# EAGLE design fb20-5 (EAGLE 6.3)
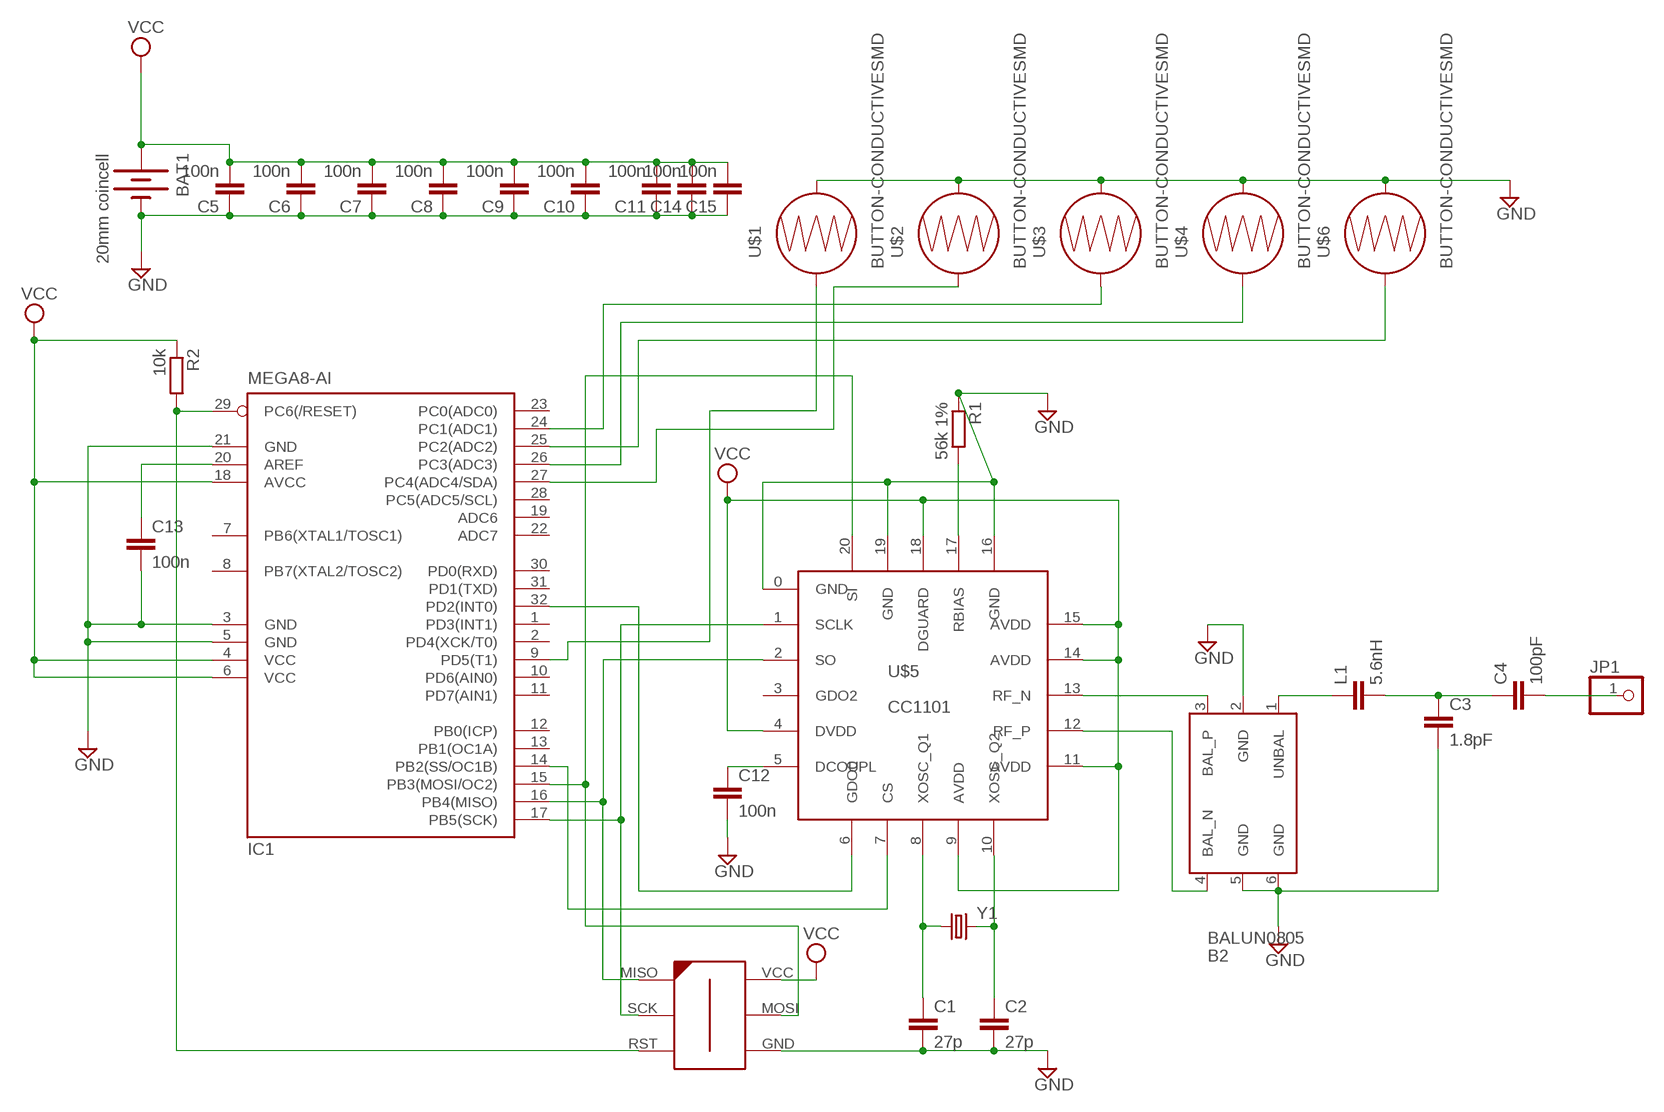
[diagram p0: schematic, sheet 1]

## Parts
B2  BALUN0805  [BALUN]
BAT1  20mm coincell  BATTERY20MM_4LEGS  [BATTCON_20MM_4LEGS]
C1  27p  C-EUC0402  [C0402]
C2  27p  C-EUC0402  [C0402]
C3  1.8pF  C-EUC0402  [C0402]
C4  100pF  C-EUC0402  [C0402]
C5  100n  C-EUC0402  [C0402]
C6  100n  C-EUC0402  [C0402]
C7  100n  C-EUC0402  [C0402]
C8  100n  C-EUC0402  [C0402]
C9  100n  C-EUC0402  [C0402]
C10  100n  C-EUC0402  [C0402]
C11  100n  C-EUC0402  [C0402]
C12  100n  C-EUC0402  [C0402]
C13  100n  C-EUC0402  [C0402]
C14  100n  C-EUC0402  [C0402]
C15  100n  C-EUC0402  [C0402]
IC1  MEGA8-AI  [TQFP32-08]
JP1  PINHD-1X1  [1X01]
L1  5.6nH  C-EUC0603  [C0603]
R1  56k 1%  R-EU_R0402  [R0402]
R2  10k  R-EU_R0402  [R0402]
U$1  BUTTON-CONDUCTIVESMD  [BUTTON-CONDUCTIVE]
U$2  BUTTON-CONDUCTIVESMD  [BUTTON-CONDUCTIVE]
U$3  BUTTON-CONDUCTIVESMD  [BUTTON-CONDUCTIVE]
U$4  BUTTON-CONDUCTIVESMD  [BUTTON-CONDUCTIVE]
U$5  CC1101  [QFN20]
U$6  BUTTON-CONDUCTIVESMD  [BUTTON-CONDUCTIVE]
U$7  AVR-ISP-6-EDGE  [6PAD_ISP]
Y1  CRYSTAL5X3  [CRYSTAL-SMD-5X3]

## Nets
GND: B2.2(GND) B2.5(GND) B2.6(GND) BAT1.2(-) C1.2 C2.2 C3.2 C5.1 C6.1 C7.1 C8.1 C9.1 C10.1 C11.1 C12.2 C13.2 C14.1 C15.1 IC1.3(GND) IC1.5(GND) IC1.21(GND) R1.1 U$1.2 U$2.2 U$3.2 U$4.2 U$5.0(GND) U$5.16(GND) U$5.19(GND) U$6.2 U$7.GND
N$1: B2.3(BAL_P) U$5.13(RF_N)
N$2: B2.4(BAL_N) U$5.12(RF_P)
N$3: C1.1 U$5.8(XOSC_Q1) Y1.1
N$4: C2.1 U$5.10(XOSC_Q2) Y1.3
N$5: IC1.17(PB5(SCK)) U$5.1(SCLK) U$7.SCK
N$6: IC1.14(PB2(SS/OC1B)) U$5.7(CS)
N$7: IC1.29(PC6(/RESET)) R2.2 U$7.RST
N$8: IC1.32(PD2(INT0)) U$5.6(GDO0)
N$9: B2.1(UNBAL) L1.1
N$10: C3.1 C4.1 L1.2
N$11: R1.2 U$5.17(RBIAS)
N$12: IC1.16(PB4(MISO)) U$5.2(SO) U$7.MISO
N$13: IC1.15(PB3(MOSI/OC2)) U$5.20(SI) U$7.MOSI
N$14: C12.1 U$5.5(DCOUPL)
N$15: C13.1 IC1.20(AREF)
N$16: IC1.9(PD5(T1)) U$1.1
N$17: IC1.27(PC4(ADC4/SDA)) U$2.1
N$18: IC1.24(PC1(ADC1)) U$3.1
N$19: IC1.26(PC3(ADC3)) U$4.1
N$20: C4.2 JP1.1
N$21: IC1.25(PC2(ADC2)) U$6.1
VCC: BAT1.1(+) C5.2 C6.2 C7.2 C8.2 C9.2 C10.2 C11.2 C14.2 C15.2 IC1.4(VCC) IC1.6(VCC) IC1.18(AVCC) R2.1 U$5.4(DVDD) U$5.9(AVDD) U$5.11(AVDD) U$5.14(AVDD) U$5.15(AVDD) U$5.18(DGUARD) U$7.VCC
Unconnected: IC1.1(PD3(INT1)) IC1.2(PD4(XCK/T0)) IC1.7(PB6(XTAL1/TOSC1)) IC1.8(PB7(XTAL2/TOSC2)) IC1.10(PD6(AIN0)) IC1.11(PD7(AIN1)) IC1.12(PB0(ICP)) IC1.13(PB1(OC1A)) IC1.19(ADC6) IC1.22(ADC7) IC1.23(PC0(ADC0)) IC1.28(PC5(ADC5/SCL)) IC1.30(PD0(RXD)) IC1.31(PD1(TXD)) U$5.3(GDO2)

## Library data of the parts
B2 = Alis custom parts:BALUN: 0805 footprint balun- Ember 351/357
BAT1 = Alis custom parts:BATTERY: Battery Holders Various common sizes : AA, AAA, 20mm coin cell and 12mm coin cell. 20MM_4LEGS, BATT-10373; PROD_ID: BATT-10373
C1-C15 L1 = rcl:C-EU: CAPACITOR, European symbol
IC1 = atmel:MEGA8: MICROCONTROLLER 8 Kbytes FLASH, 1 kbytes SRAM, 512 bytes EEPROM, USART, 6-channel 10 bit ADC, 2-channel 8 bit ADC Pin compatible with Atmega48, ATMega88, ATMega168 Source: avr.lbr; MPN: ATMEGA8-16AU; OC_FARNELL: 9171371; OC_NEWARK: 73M8863
JP1 = pinhead:PINHD-1X1: PIN HEADER
R1 R2 = rcl:R-EU_: RESISTOR, European symbol
U$1-U$4 U$6 = Alis custom parts:BUTTON-CONDUCTIVE: Used with rubber key pads. This one was designed and proven to work with the PolyCase Key FOB enclosures.
U$5 = Alis custom parts:CC1101
U$7 = avr-7:AVR-ISP-6-EDGE: 6 pin edge connector for ISP with ATMEL MCUs. Developed by Craig Moates (craig at moates dot net). Library by David Blundell (blundar at gmail dot com). Often, even a 6 pin header is really inconvenient for board layout and/or production. This SMD-only header is our de-facto standard for using an edge connector for programming with the help of a 6pin/10pin to edge card adapter.
Y1 = SparkFun-FreqCtrl:CRYSTAL: Various standard crystals. Proven footprints. Spark Fun Electronics SKU : COM-00534

## Board
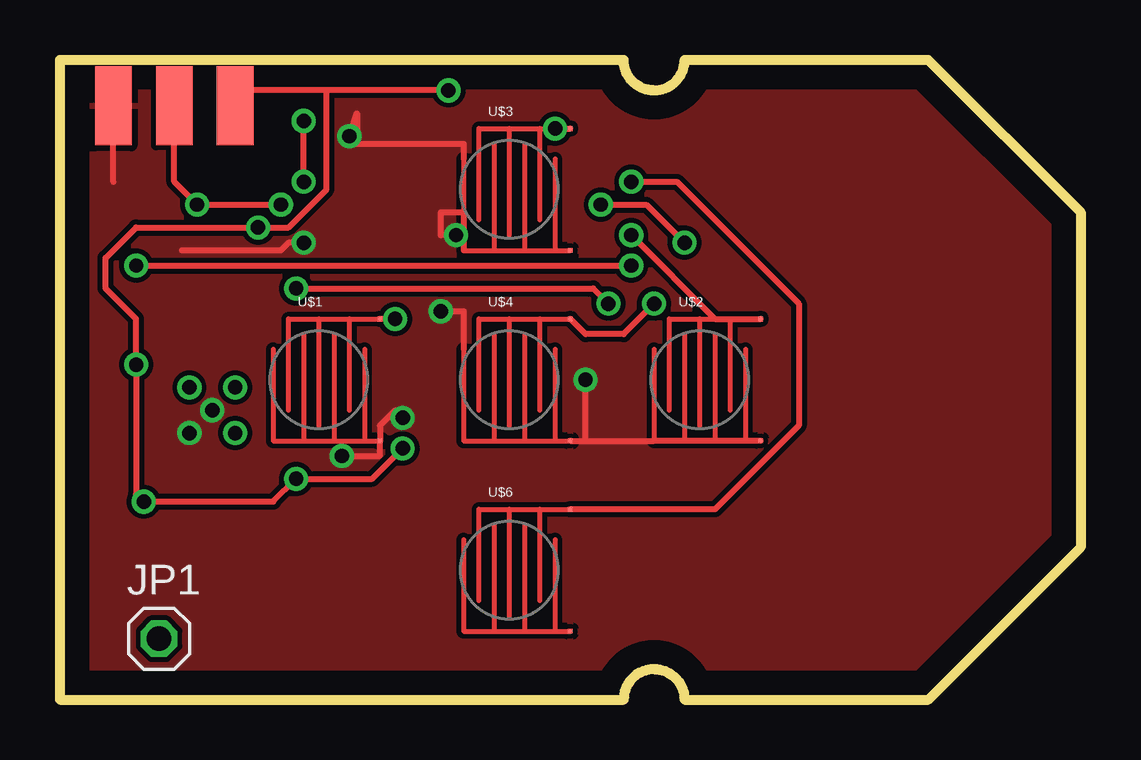
[diagram p1: board, top side]
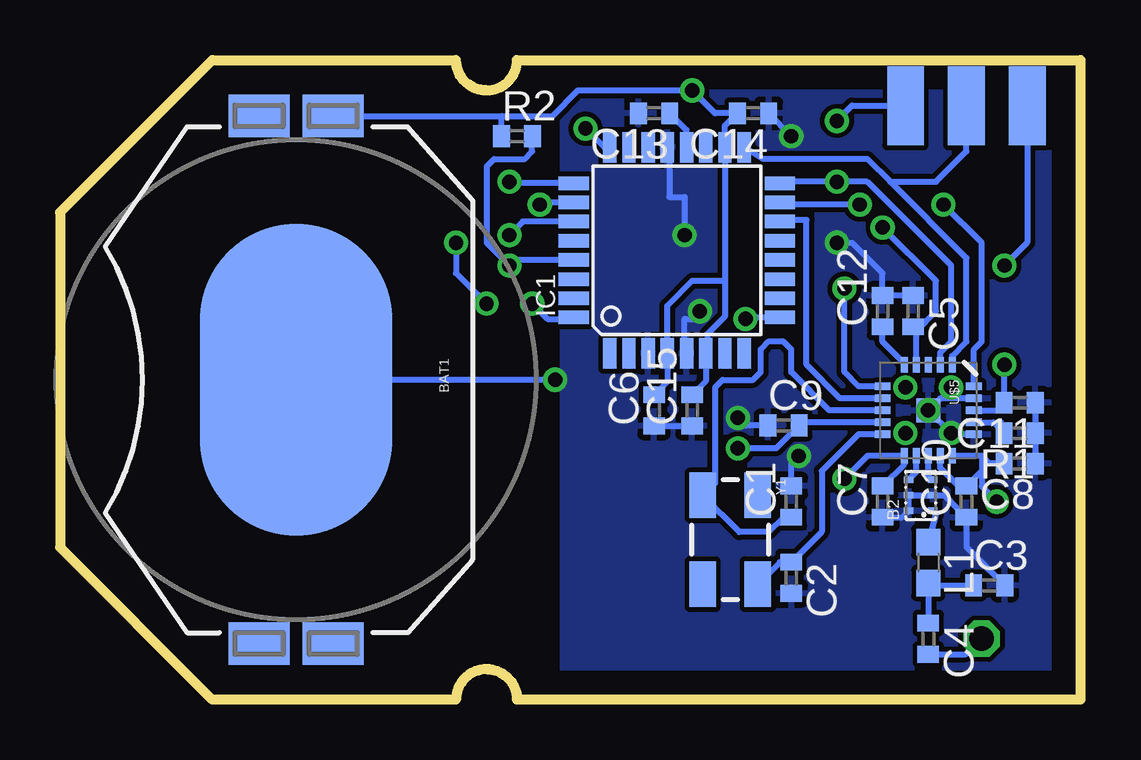
[diagram p2: board, bottom side, seen from below]

Size 42.55 x 26.67 mm. Coordinates in mm from the lower left corner, seen from the top.
Outline: 0,0 0,26.67 23.5,26.67 arc90 24.77,25.4 arc90 26.04,26.67 36.19,26.67 42.55,20.32 42.55,6.35 36.19,0 26.04,0 arc90 24.77,1.27 arc90 23.5,0 0,0
Copper layers (1*16): Top 0.035mm / dielectric 1.5mm / Bottom 0.035mm
Design rules "default *": minimum track width 10mil, minimum drill 24mil, track to track 8mil, track to pad 8mil, pad to pad 8mil, via to via 8mil, smd to smd 8mil, copper to edge 40mil, drill to drill 8mil, minimum pad ring 10mil, minimum via ring 8mil, stop-mask expansion 4mil, vias tented up to drill 0mil, thermal gap 10mil
bKeepout: 1 lines

### Footprints (pad centres in the part's own frame; a part is rotated, then mirrored left to right if it is on the bottom)
BALUN = smd 0.27 x 0.4: 1 -0.7,-0.5; 2 -0.05,-0.5; 3 0.6,-0.5; 4 0.6,0.5; 5 -0.05,0.5; 6 -0.7,0.5
BATTCON_20MM_4LEGS = smd 1.778 x 2.54: 1 -11,1.55; 3 11,1.55; P$1 -11,-1.55; P$2 11,-1.55 | smd 13 x 8: 2 0,0
C0402 = smd 0.7 x 0.9: 1 -0.65,0; 2 0.65,0
TQFP32-08 = smd 1.27 x 0.559: 1 -4.293,2.8; 2 -4.293,2; 3 -4.293,1.2; 4 -4.293,0.4; 5 -4.293,-0.4; 6 -4.293,-1.2; 7 -4.293,-2; 8 -4.293,-2.8; 17 4.293,-2.8; 18 4.293,-2; 19 4.293,-1.2; 20 4.293,-0.4; 21 4.293,0.4; 22 4.293,1.2; 23 4.293,2; 24 4.293,2.8 | smd 0.559 x 1.27: 9 -2.8,-4.293; 10 -2,-4.293; 11 -1.2,-4.293; 12 -0.4,-4.293; 13 0.4,-4.293; 14 1.2,-4.293; 15 2,-4.293; 16 2.8,-4.293; 25 2.8,4.293; 26 2,4.293; 27 1.2,4.293; 28 0.4,4.293; 29 -0.4,4.293; 30 -1.2,4.293; 31 -2,4.293; 32 -2.8,4.293
1X01 = drill 1.016 octagon: 1 0,0
C0603 = smd 1.1 x 1: 1 -0.85,0; 2 0.85,0
R0402 = smd 0.7 x 0.9: 1 -0.65,0; 2 0.65,0
BUTTON-CONDUCTIVE = smd 0.203 x 0.203: 1 2.54,2.54; 2 2.54,-2.54
QFN20 = smd 1 x 1: 0 0,0 | smd 0.65 x 0.3: 1 -1.9,1; 2 -1.9,0.5; 3 -1.9,0; 4 -1.9,-0.5; 5 -1.9,-1; 11 1.9,-1; 12 1.9,-0.5; 13 1.9,0; 14 1.9,0.5; 15 1.9,1 | smd 0.3 x 0.65: 6 -1,-1.9; 7 -0.5,-1.9; 8 0,-1.9; 9 0.5,-1.9; 10 1,-1.9; 16 1,1.9; 17 0.5,1.9; 18 0,1.9; 19 -0.5,1.9; 20 -1,1.9
6PAD_ISP = smd 1.524 x 3.302 bottom: GND 2.54,0; MOSI 0,0; VCC -2.54,0 | smd 1.524 x 3.302: MISO -2.54,0; RST 2.54,0; SCK 0,0
CRYSTAL-SMD-5X3 = smd 1.9 x 1.1: 1 -1.85,-1.15; 2 1.85,-1.15; 3 1.85,1.15; 4 -1.85,1.15

### Placement (x,y rotation side)
B2  6.67,8.57 90 bottom
BAT1  32.7,13.34 270 bottom
C1  12.07,8.26 90 bottom
C2  12.07,5.08 270 bottom
C3  3.81,4.76 0 bottom
C4  6.35,2.54 270 bottom
C5  6.99,16.19 270 bottom
C6  17.78,12.07 90 bottom
C7  8.26,8.26 90 bottom
C8  2.54,9.84 180 bottom
C9  12.38,11.43 0 bottom
C10  4.76,8.26 90 bottom
C11  2.54,12.38 180 bottom
C12  8.26,16.19 90 bottom
C13  17.78,24.45 180 bottom
C14  13.65,24.45 180 bottom
C15  16.19,12.07 90 bottom
IC1  16.83,18.73 90 bottom
JP1  4.13,2.54 0 top
L1  6.35,5.72 270 bottom
R1  2.54,11.11 180 bottom
R2  23.5,23.5 0 bottom
U$1  10.8,13.34 0 top
U$2  26.67,13.34 0 top
U$3  18.73,21.27 0 top
U$4  18.73,13.34 0 top
U$5  6.35,12.07 270 bottom
U$6  18.73,5.4 0 top
U$7  4.76,24.77 0 bottom
Y1  14.61,6.67 270 bottom

### Tracks (layer width: path | path; a pad name or v marks a point on that pad's centre or on a via)
GND  (via drill 0.6 pad 0.25)
  Top 0.254: 2.22,21.59 U$7.GND | v10.16,19.05 9.52,19.05 9.21,18.73 5.08,18.73 | U$2.2 24.77,10.8 21.91,10.8 | 21.91,10.8 v21.91,13.34 | v16.51,19.37 15.88,19.37 15.88,20.32 16.83,20.32 16.83,18.73 | v12.07,23.5 12.38,24.45 12.38,23.18 16.83,23.18 16.83,22.54 | v15.88,16.19 16.83,16.19 16.83,14.61 | v14.29,11.75 14.29,12.07 13.97,12.07 13.33,11.43 U$1.2 13.33,10.16 v11.75,10.16 | U$4.2 21.91,10.8
  Bottom 0.254: C7.1 7.43,7.61 B2.6 B2.5 B2.2 5.68,8.52 C10.1 4.76,6.37 C3.2 | C6.1 C15.1 | C11.1 R1.1 C8.1 | U$5.16 5.35,11.07 v5.4,11.11 U$5.0 5.85,12.57 U$5.19 | C5.1 C12.2 8.25,17.78 9.52,19.05 v10.16,19.05 | v21.91,13.34 BAT1.2 | IC1.21 17.14,23.02 17.14,20.96 16.51,20.96 v16.51,19.37 | C14.1 v12.07,23.5 | IC1.5 16.51,14.44 16.51,15.88 15.88,15.88 v15.88,16.19 | C9.1 13.97,11.43 v14.29,11.75 | C1.2 12.07,10.16 v11.75,10.16
  other vias: 6.35,12.07
  pour Top: 0.32,0.32 36.2,0.32 42.23,6.35 42.23,20.32 36.2,26.35 0.32,26.35
  pour Bottom: 5.08,10.8 7.62,10.8 7.62,13.34 5.08,13.34
  pour Bottom: 0,26.67 21.59,26.67 21.59,0 0,0
N$1
  Bottom 0.254: B2.3 6.35,9.36 U$5.13
N$2
  Bottom 0.254: B2.4 6.85,9.49 U$5.12
N$3
  Bottom 0.254: U$5.8 10.48,12.07 12.07,13.65 12.07,14.61 12.38,14.92 13.02,14.92 13.33,14.61 13.33,13.65 13.65,13.34 14.92,13.34 15.24,13.02 15.24,9.03 Y1.1 14.22,6.99 13.02,6.99 12.4,7.61 C1.1
N$4
  Bottom 0.254: U$5.10 9.25,11.07 10.8,9.53 10.8,7 C2.1 12.54,5.73 Y1.3
N$5
  Bottom 0.254: U$5.1 5.35,14.34 4.76,14.92 4.76,18.41 7.94,21.59 | IC1.17 13.24,22.54 8.89,22.54 7.94,21.59 | 7.94,21.59 6.03,21.59 4.76,22.86 U$7.SCK
N$6
  Bottom 0.254: U$5.7 10.02,12.57 11.43,13.97 11.43,20 12.46,20 IC1.14
N$7  (via drill 0.6 pad 0.25)
  Top 0.254: v3.17,18.1 v23.81,18.1
  Bottom 0.254: U$7.RST 2.22,19.05 v3.17,18.1 | IC1.29 23.58,18.33 v23.81,18.1 24.75,19.04 24.75,22.24 24.45,22.54 23.18,22.54 22.86,22.86 22.86,23.48 R2.2
N$8  (via drill 0.6 pad 0.25)
  Top 0.254: v9.84,17.14 22.23,17.14 v22.86,16.51
  Bottom 0.254: U$5.6 9.25,13.07 9.84,13.65 v9.84,17.14 | v22.86,16.51 22.23,15.88 21.18,15.88 IC1.32
N$9
  Bottom 0.254: B2.1 6.03,7.74 L1.1
N$10
  Bottom 0.254: C4.1 L1.2 5.93,4.76 C3.1
N$11
  Bottom 0.254: 3.32,11.57 R1.2 3.64,11.57 U$5.17
N$12  (via drill 0.6 pad 0.25)
  Top 0.254: v10.16,21.59 v10.16,24.13
  Bottom 0.254: U$5.2 5.85,14.47 5.4,14.92 5.4,18.1 8.89,21.59 v10.16,21.59 12.48,21.59 IC1.16 | v10.16,24.13 9.52,24.77 U$7.MISO
N$13  (via drill 0.6 pad 0.25)
  Top 0.254: v9.21,20.64 v5.72,20.64 4.76,21.59 U$7.MOSI
  Bottom 0.254: U$5.20 4.45,14.6 4.13,14.92 4.13,19.05 v5.72,20.64 | v9.21,20.64 12.44,20.64 IC1.15
N$14
  Bottom 0.254: U$5.5 7.35,14.02 8.25,14.92 C12.1
N$15
  Bottom 0.254: IC1.20 16.43,23.75 C13.1
N$16  (via drill 0.6 pad 0.25)
  Top 0.254: v13.97,15.88 U$1.1
  Bottom 0.254: IC1.9 13.91,15.93 v13.97,15.88
N$17  (via drill 0.6 pad 0.25)
  Top 0.254: v23.81,19.37 27.3,15.88 U$2.1
  Bottom 0.254: IC1.27 23.25,19.93 v23.81,19.37
N$18  (via drill 0.6 pad 0.25)
  Top 0.254: v20.64,23.81 U$3.1
  Bottom 0.254: IC1.24 19.85,23.02 v20.64,23.81
N$19  (via drill 0.6 pad 0.25)
  Top 0.254: v22.54,20.64 24.45,20.64 v26.04,19.05 | v24.77,16.51 23.5,15.24 21.91,15.24 U$4.1
  Bottom 0.254: IC1.26 22.45,20.73 v22.54,20.64 | v26.04,19.05 26.04,17.78 v24.77,16.51
N$20
  Bottom 0.254: C4.2 4.78,1.89 JP1.1
N$21  (via drill 0.6 pad 0.25)
  Top 0.254: v23.81,21.59 25.72,21.59 30.8,16.51 30.8,11.43 27.3,7.94 U$6.1
  Bottom 0.254: IC1.25 23.75,21.53 v23.81,21.59
N$24  (via drill 0.6 pad 0.25)
  other vias: 7.3,13.02
N$25  (via drill 0.6 pad 0.25)
  other vias: 5.4,13.02
N$26  (via drill 0.6 pad 0.25)
  other vias: 7.3,11.11
VCC  (via drill 0.6 pad 0.25)
  Top 0.254: v16.19,25.4 11.11,25.4 | 11.11,25.4 7.94,25.4 U$7.VCC | v14.29,10.48 13.02,9.21 v9.84,9.21 8.89,8.26 v3.49,8.26 | 11.11,25.4 11.11,21.27 9.52,19.69 v8.25,19.69 3.17,19.69 1.91,18.41 1.91,17.14 3.17,15.88 v3.17,13.97 3.17,8.57 | 3.17,8.57 3.17,8.26 v3.49,8.26 | v3.49,8.26 3.17,8.57
  Bottom 0.254: C11.2 3.51,12.07 U$5.18 3.49,12.07 3.17,12.38 v3.17,13.97 | C8.2 3.81,9.84 4.13,10.16 | 4.13,10.16 U$5.15 | 5.1,8.91 C10.2 4.13,9.54 4.13,10.16 | U$5.14 5.85,9.66 5.1,8.91 | C7.2 7.35,9.81 U$5.11 8.89,10.17 v9.84,9.21 | U$5.9 11.6,11.57 C9.2 11.75,11.43 12.7,10.48 v14.29,10.48 | C15.2 15.63,13.28 IC1.6 15.56,14.51 15.56,15.24 14.83,15.97 14.83,17.46 | IC1.4 17.23,13.27 C6.2 | C5.2 6.85,15.41 U$5.4 6.85,15.38 6.03,16.19 6.03,17.46 v8.25,19.69 | IC1.4 17.23,15.79 | 14.83,17.46 IC1.18 14.83,23.92 C14.2 15.24,24.45 v16.19,25.4 20.95,25.4 22.02,24.34 24.13,24.34 | 5.1,8.91 5.08,8.89 4.76,8.89 4.13,9.53 4.13,8.89 v3.49,8.26 | IC1.4 17.23,16.43 16.19,17.46 14.83,17.46 | BAT1.1 24.13,24.34 | R2.1 24.15,24.32 24.13,24.34